# EAGLE design control1 (EAGLE 9.4.1)
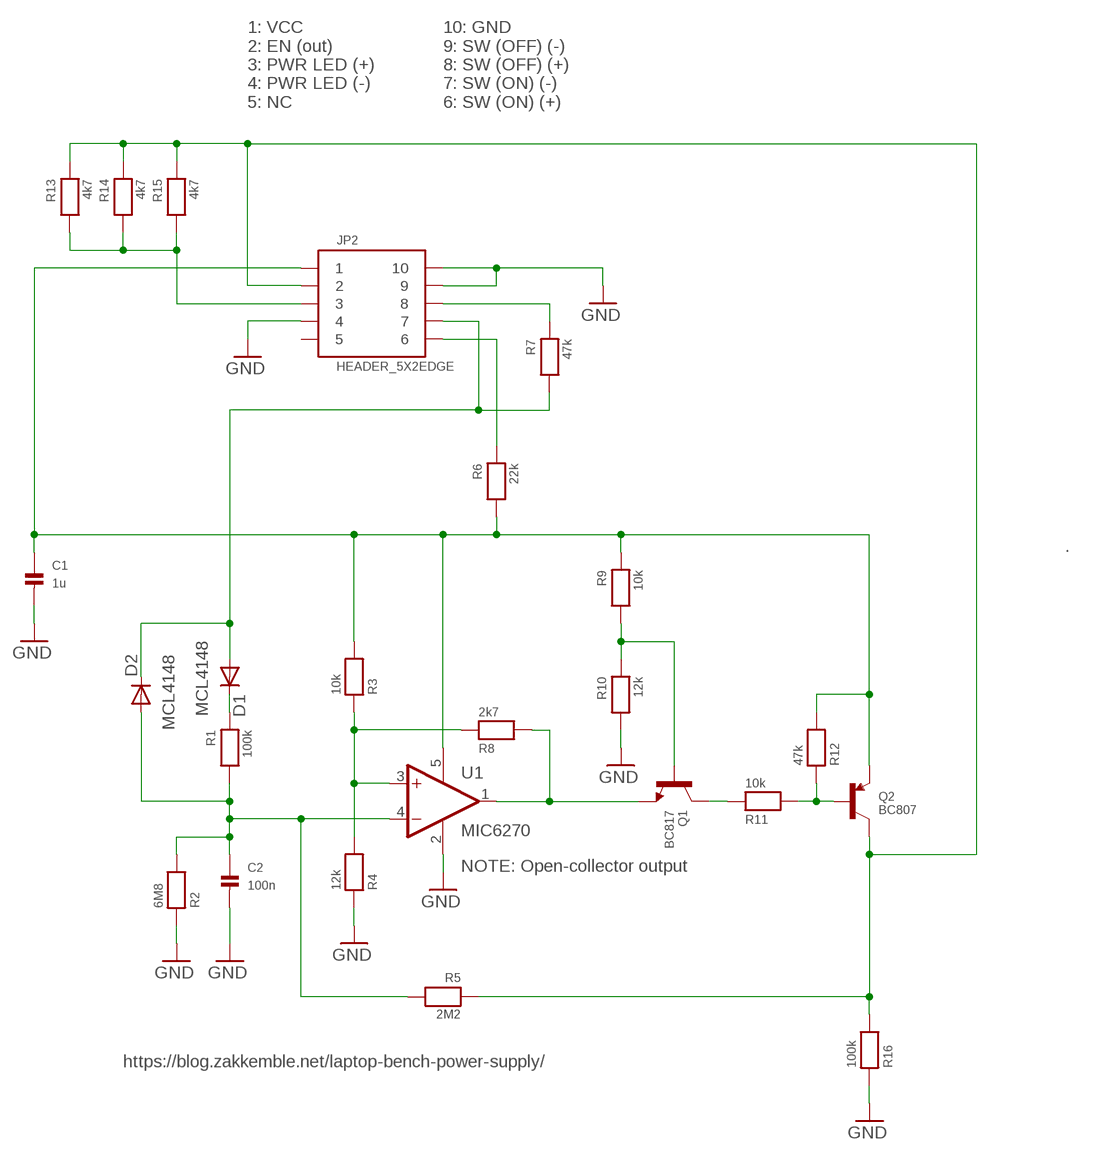
[diagram p0: schematic, sheet 1]

## Parts
C1  1u  CAP_CERAMIC0402  [0402]
C2  100n  CAP_CERAMIC_0603MP  [_0603MP]
D1  MCL4148  DIODE-MICROMELF-R  [MICROMELF-R]
D2  MCL4148  DIODE-MICROMELF-R  [MICROMELF-R]
JP2  HEADER_5X2EDGE  [HEADER_EDGE_5X2]
Q1  BC817  TRANSISTOR_NPNWIDE  [SOT23-WIDE]
Q2  BC807  TRANSISTOR_PNPWIDE  [SOT23-WIDE]
R1  100k  RESISTOR0402  [0402]
R2  6M8  RESISTOR0402  [0402]
R3  10k  RESISTOR0402  [0402]
R4  12k  RESISTOR0402  [0402]
R5  2M2  RESISTOR0402  [0402]
R6  22k  RESISTOR0402  [0402]
R7  47k  RESISTOR0402  [0402]
R8  2k7  RESISTOR0402  [0402]
R9  10k  RESISTOR0402  [0402]
R10  12k  RESISTOR0402  [0402]
R11  10k  RESISTOR0402  [0402]
R12  47k  RESISTOR0402  [0402]
R13  4k7  RESISTOR0402  [0402]
R14  4k7  RESISTOR0402  [0402]
R15  4k7  RESISTOR0402  [0402]
R16  100k  RESISTOR0402  [0402]
U1  MIC6270  [SOT95P275X110-5N]

## Nets
GND: C1.2 C2.2 JP2.4 JP2.9 JP2.10 R2.1 R4.1 R10.2 R16.1 U1.2(GND)
N$1: C1.1 JP2.1 Q2.2(E) R3.2 R6.2 R9.1 R12.2 U1.5(V+)
N$2: JP2.8 R7.1
N$3: JP2.3 R13.2 R14.2 R15.2
N$5: R3.1 R4.2 R8.1 U1.3(+IN)
N$6: C2.1 D2.A R1.2 R2.2 R5.2 U1.4(-IN)
N$9: JP2.6 R6.1
N$13: JP2.2 Q2.3(C) R5.1 R13.1 R14.1 R15.1 R16.2
N$14: Q1.3(C) R11.1
N$18: Q2.1(B) R11.2 R12.1
N$21: Q1.2(E) R8.2 U1.1(OUT)
N$24: Q1.1(B) R9.2 R10.1
N$33: D1.A D2.C JP2.7 R7.2
N$34: D1.C R1.1
Unconnected: JP2.5

## Notes on the sheet
- 1: VCC
  2: EN (out)
  3: PWR LED (+)
  4: PWR LED (-)
  5: NC
- 10: GND
  9: SW (OFF) (-)
  8: SW (OFF) (+)
  7: SW (ON) (-)
  6: SW (ON) (+)
- .
- NOTE: Open-collector output
- https://blog.zakkemble.net/laptop-bench-power-supply/

## Library data of the parts
C1 = zak:CAP_CERAMIC
C2 = microbuilder:CAP_CERAMIC: Ceramic Capacitors 0402 - 0402 Surface Mount Capacitors 16pF 50V 5% [Digikey: 445-4899-2-ND] 18pF 50V 5% [Digikey: 490-1281-2-ND] 22pF 50V 5% [Digikey: 490-1283-2-ND] 68pF 50V 5% [Digikey: 490-1289-2-ND] 0.1uF 10V 10% [Digikey: 490-1318-2-ND] 1.0uF 6.3V 10% [Digikey: 490-1320-2-ND] 0603 - 0603 Surface Mount Capacitors 16 pF 50V 5% [Digikey: 445-5051-2-ND] 22 pF 50V [Digikey: PCC220ACVTR-ND] 33 pF 50V 5% [Digikey: 490-1415-1-ND] 56pF 50V 5% [Digikey: 490-1421-1-ND] 220pF 50V 5% [Digikey: 445-1285-1-ND] 680 pF 50V 2200 pF 50V 5% C0G [Digikey: 445-1297-1-ND] 5600 pF 100V 5% X7R [Digikey: 478-3711-1-ND] 0.1 µF 25V 10% [Digikey: PCC2277TR-ND] 0.22 µF 16V 10% X7R [Digikey: 445-1318-1-ND] 1.0 µF 25V 10% [Digikey: 445-5146-2-ND] 0603 - RF Specific 3pF 250V +/-0.1pF RF [Digikey: 712-1347-1-ND] 18 pF 250V 5% [Digikey: 478-3505-1-ND or 712-1322-1-ND] 56 pF 250V 5% C0G RF [Digikey: 490-4867-1-ND] 68 pF 250V RF [Digikey: 490-4868-1-ND] 0805 - 0805 Surface Mount Capacitors 220 pF 250V 2% RF Ceramic Capacitor [Digikey: 712-1398-1-ND] 1000 pF 50V 2% NP0 Ceramic Capacitor [Digikey: 478-3760-1-ND] 0.1 µF 25V 10% Ceramic Capacitor [Digikey: PCC1828TR-ND] 1.0 µF 16V 10% Ceramic Capacitor[Digikey: 490-1691-2-ND] 10.0 µF 10V 10% Ceramic Capacitor[Digikey: 709-1228-1-ND] 10.0 uF 16V 10% Ceramic Capacitor [Digikey: 478-5165-2-ND] 47 uF 6.3V 20% Ceramic Capacitor [Digikey: 587-1779-1-ND or 399-5506-1-ND] 1206 - 1206 Surface Mount Capacitors 47uF 10V 20% Ceramic Capacitor [Digikey: 490-5528-1-ND or 399-5508-1-ND or 445-6010-1-ND] 100uF 6.3V -20%, +80% Y5V Ceramic Capacitor (Digikey: 490-4512-1-ND, Mouser: 81-GRM31CF50J107ZE1L)
D1 D2 = diode:DIODE-: DIODE
JP2 = zak:HEADER_5X2
Q1 = microbuilder:TRANSISTOR_NPN: NPN Transistor Transistor (NPN) 500mA 45V - BC817 [Digikey: 568-1631-1-ND] Transistor (NPN) 500mA 45V - BC817,215 [Mouser: 771-BC817-T/R] SOT23-R - SOT23 footprint optimised for use with solder paste and reflow ovens. SOT23-W - SOT23 footprint optimised for hand-soldering (larger pads).
Q2 = microbuilder:TRANSISTOR_PNP: PNP Transistor Transistor (PNP) 800mA 60V, 1.6V VCE @ 500mA [Digikey: MMBT2907AFSTR-ND] Transistor (PNP) Low Sat - 1.5A 20V, 260mV VCE @ 400mA [Digikey: ZXTP25020DFLTR-ND] SOT23-R - SOT23 footprint optimised for use with solder paste and reflow ovens. SOT23-W - SOT23 footprint optimised for hand-soldering (larger pads).
R1-R16 = zak:RESISTOR
U1 = zak:MIC6270

## Board
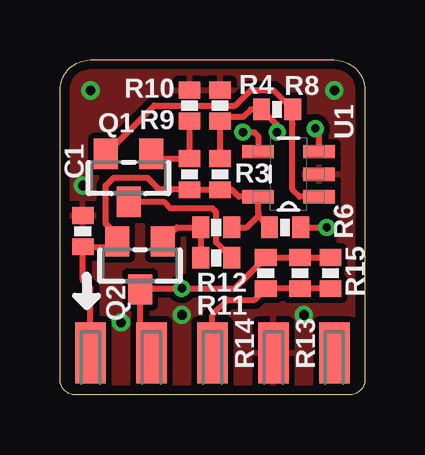
[diagram p1: board, top side]
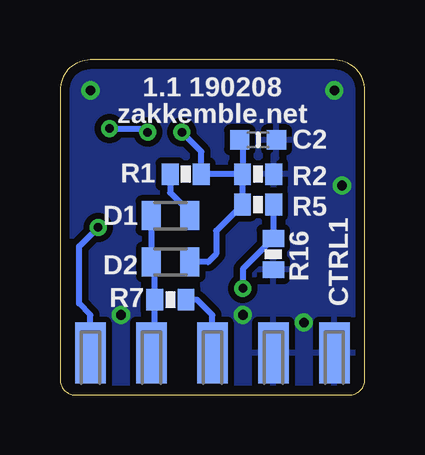
[diagram p2: board, bottom side, seen from below]

Size 12.7 x 13.97 mm. Coordinates in mm from the lower left corner, seen from the top.
Outline: 1.27,13.97 11.43,13.97 arc-90 12.7,12.7 12.7,0.64 arc-90 12.06,0 0.64,0 arc-90 0,0.64 0,12.7 arc-90 1.27,13.97
Copper layers (1*16): Top 0.0356mm / dielectric 1.5011mm / Bottom 0.0356mm
Design rules "LaenPCBOrder *": minimum track width 6mil, minimum drill 13mil, track to track 6mil, track to pad 6mil, pad to pad 6mil, via to via 6mil, smd to smd 6mil, copper to edge 15mil, drill to drill 6mil, minimum pad ring 7mil, minimum via ring 7mil, stop-mask expansion 4mil, vias tented up to drill 26mil, thermal gap 10mil

### Footprints (pad centres in the part's own frame; a part is rotated, then mirrored left to right if it is on the bottom)
0402 = smd 0.7 x 0.9: 1 -0.65,0; 2 0.65,0
_0603MP = smd 0.8 x 0.8: 1 -0.762,0; 2 0.762,0
MICROMELF-R = smd 0.8 x 1.2: A 0.8,0; C -0.8,0
HEADER_EDGE_5X2 = smd 1.27 x 2.54: 1 -5.08,0; 2 -2.54,0; 3 0,0; 4 2.54,0; 5 5.08,0 | smd 1.27 x 2.54 bottom: 6 5.08,0; 7 2.54,0; 8 0,0; 9 -2.54,0; 10 -5.08,0
SOT23-WIDE = smd 1 x 1.27: 1 -0.95,-1; 2 0.95,-1; 3 0,1
SOT95P275X110-5N = smd 1.321 x 0.559: 1 -1.27,0.94; 2 -1.27,0; 3 -1.27,-0.94; 4 1.27,-0.94; 5 1.27,0.94

### Placement (x,y rotation side)
C1  0.95,6.83 90 top
C2  4.45,10.64 0 bottom
D1  8.1,7.48 180 bottom
D2  8.09,5.54 0 bottom
JP2  6.35,1.75 0 top
Q1  2.86,9.05 180 top
Q2  3.33,5.4 180 top
R1  7.46,9.21 0 bottom
R2  4.45,9.21 180 bottom
R3  6.67,9.21 270 top
R4  6.67,12.06 270 top
R5  4.45,7.94 180 bottom
R6  9.38,6.99 180 top
R7  8.1,3.97 180 bottom
R8  9.05,11.91 0 top
R9  5.4,9.21 90 top
R10  5.4,12.06 90 top
R11  6.51,5.71 180 top
R12  6.51,6.99 0 top
R13  10,5.08 270 top
R14  8.57,5.08 270 top
R15  11.27,5.08 270 top
R16  3.81,5.87 90 bottom
U1  9.53,9.21 180 top

### Tracks (layer width: path | path; a pad name or v marks a point on that pad's centre or on a via)
GND  (via drill 0.4)
  other vias: 10.16,3.33 5.08,3.33 11.43,12.7 1.27,12.7 2.54,3.02 0.95,8.73
  pour Top (isolate 0.254, rank 6): 0,13.97 12.7,13.97 12.7,0 0,0
  pour Bottom (isolate 0.254, rank 6): 0,13.97 0,0 12.7,0 12.7,13.97
N$1
  Top 0.254: JP2.1 1.27,4.45 0.95,4.76 C1.1 2.16,6.18 Q2.2 2.06,6.72 2.06,6.99 1.91,7.14 1.91,8.73 2.22,9.05 3.65,9.05 4.14,8.56 R9.1 R3.2 7.16,8.56 7.45,8.27 U1.5 8.26,7.62 8.26,7.46 | R12.2 7.78,6.99 8.26,7.46 | 8.26,7.46 R6.2
N$2
  Bottom 0.254: JP2.8 6.35,3.33 6.99,3.97 R7.1
N$3
  Top 0.254: R15.2 R13.2 R14.2 8.11,3.97 6.99,3.97 6.35,3.33 JP2.3
N$5  (via drill 0.35)
  Top 0.254: R3.1 R4.2 | R4.2 6.68,11.43 | R4.2 6.84,11.59 7.62,11.59 7.94,11.91 R8.1 9.05,11.26 v9.05,10.95 | U1.3 10.79,10.95 v10.64,11.11
  Bottom 0.254: v10.64,11.11 9.21,11.11 v9.05,10.95
N$6  (via drill 0.35)
  Top 0.254: v7.62,10.95 8.1,10.95 8.26,10.79 U1.4
  Bottom 0.254: R2.2 R5.2 6.19,6.84 6.19,5.87 6.52,5.54 D2.A | R2.2 R1.2 6.81,10.14 v7.62,10.95 | C2.1 5.09,10.52 R2.2
N$9  (via drill 0.35)
  Top 0.254: R6.1 v11.11,6.99
  Bottom 0.254: JP2.6 11.43,3.33 11.91,3.81 11.91,6.19 v11.11,6.99
N$13  (via drill 0.35)
  Top 0.254: R15.1 R13.1 R14.1 7.29,4.45 v5.08,4.45 3.38,4.45 Q2.3 3.33,2.22 JP2.2
  Bottom 0.254: R5.1 3.81,7.92 R16.2 5.08,5.25 v5.08,4.45
N$14
  Top 0.254: Q1.3 4.33,8.05 4.6,7.78 6.35,7.78 6.51,7.62 6.51,6.35 7.14,5.71 R11.1
N$18
  Top 0.254: Q2.1 4.87,6.99 R12.1 R11.2
N$21
  Top 0.254: U1.1 9.99,8.27 9.68,8.57 9.68,11.29 R8.2 8.9,12.7 7.94,12.7 7.3,12.06 3.92,12.06 Q1.2
N$24
  Top 0.254: Q1.1 4,9.86 R9.2 R10.1
N$33
  Bottom 0.254: JP2.7 8.75,1.89 R7.2 8.75,5.39 D2.C D1.A
N$34
  Bottom 0.254: R1.1 8.11,8.43 7.3,7.62 D1.C

### Text on the board
bPlace: 1.1 190208 | zakkemble.net | CTRL1